# EAGLE schematic Arduino_I2C_LCD_Motor-Driver (EAGLE 8.6.0)
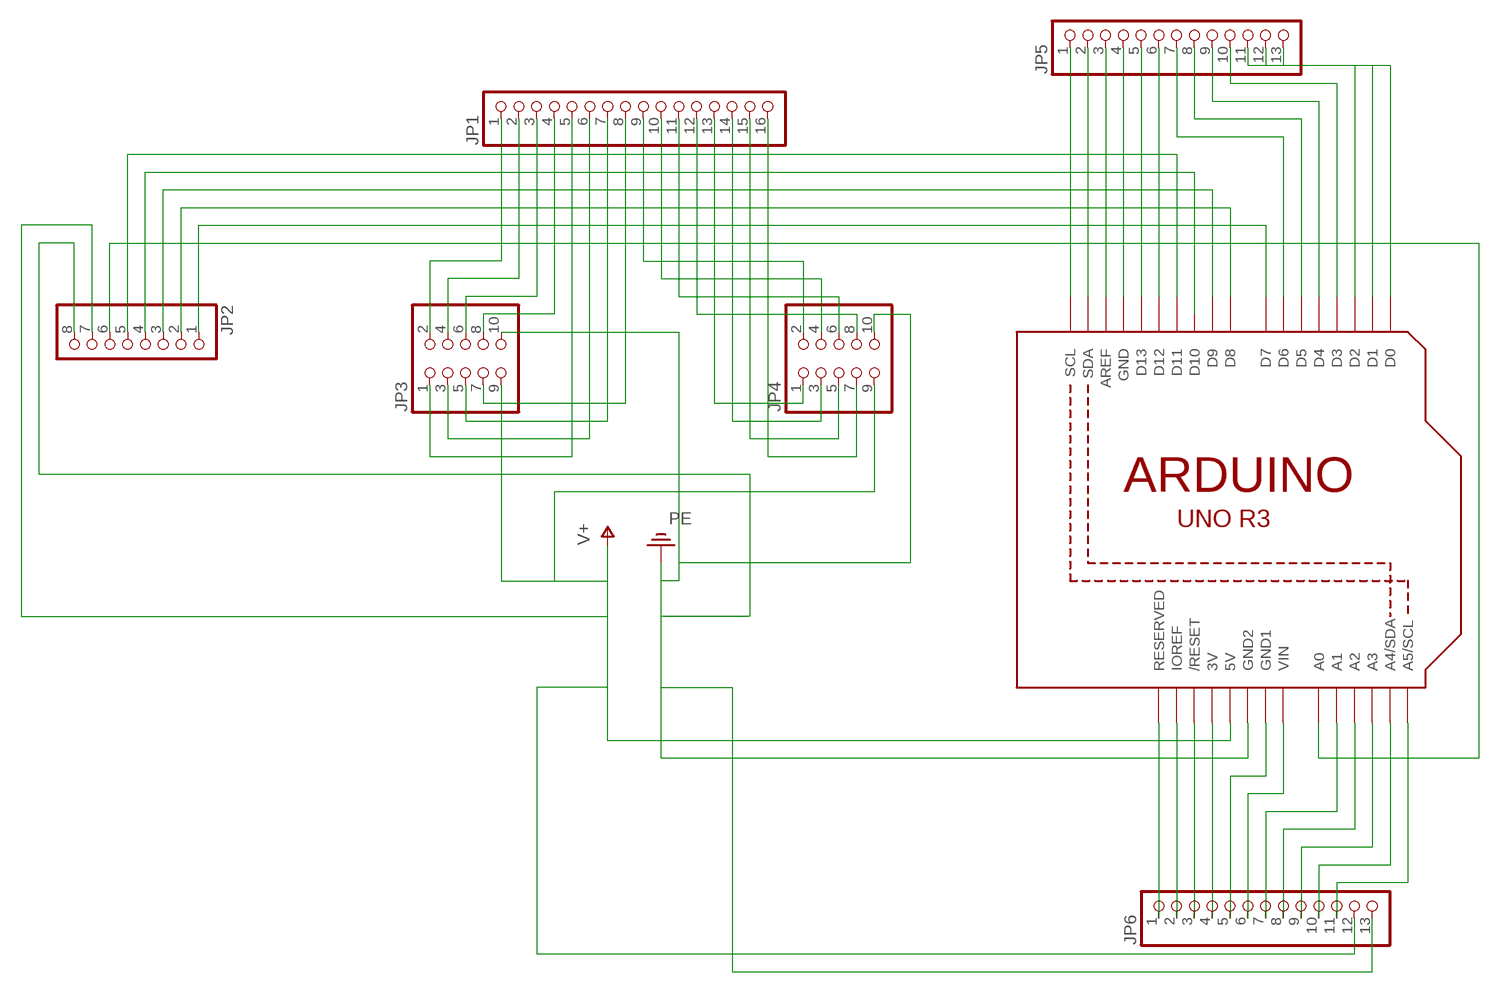
[diagram p0: schematic, sheet 1]

## Parts
JP1  PINHD-1X16  [1X16]
JP2  PINHD-1X8  [1X08]
JP3  PINHD-2X5  [2X05]
JP4  PINHD-2X5  [2X05]
JP5  PINHD-1X13  [1X13]
JP6  PINHD-1X13  [1X13]
U1  ARDUINOR3-BPLACE  [ARDUINOR3-BPLACE]

## Nets
N$1: JP2.2 U1.D8
N$2: JP2.3 U1.D9
N$3: JP2.1 U1.D7
N$4: JP2.4
N$5: JP2.5 U1.D11
N$6: JP1.1 JP3.2
N$7: JP1.2 JP3.4
N$8: JP2.6 U1.A0
N$9: JP1.3 JP3.6
N$10: JP1.4 JP3.8
N$11: JP1.5 JP3.1
N$12: JP1.6 JP3.3
N$13: JP1.7 JP3.5
N$14: JP1.8 JP3.7
N$15: JP1.9 JP4.2
N$16: JP1.10 JP4.4
N$17: JP1.11 JP4.6
N$18: JP1.12 JP4.8
N$19: JP1.13 JP4.1
N$20: JP1.14 JP4.3
N$21: JP1.15 JP4.5
N$22: JP1.16 JP4.7
N$23: JP5.1 U1.SCL
N$24: JP5.2 U1.SDA
N$25: JP5.3 U1.AREF
N$26: JP5.4 U1.GND
N$27: JP5.5 U1.D13
N$28: JP5.6 U1.D12
N$29: JP5.7 U1.D6
N$30: JP5.8 U1.D5
N$31: JP5.9 U1.D4
N$32: JP5.10 U1.D3
N$33: JP5.11 U1.D2
N$34: JP5.12 U1.D1
N$35: JP5.13 U1.D0
N$36: JP6.1 U1.RESERVED
N$37: JP6.2 U1.IOREF
N$38: JP6.3 U1.RESET(/RESET)
N$39: JP6.4 U1.3V
N$40: JP6.5 U1.GND1
N$41: JP6.6 U1.VIN
N$42: JP6.7 U1.A1
N$43: JP6.8 U1.A2
N$44: JP6.9 U1.A3
N$45: JP6.10 U1.A4(A4/SDA)
N$46: JP6.11 U1.A5(A5/SCL)
PE: JP2.8 JP3.10 JP4.10 JP6.13 U1.GND2
V+: JP2.7 JP3.9 JP4.9 JP6.12 U1.5V
Unconnected: U1.D10

## Library data of the parts
JP1 = pinhead:PINHD-1X16: PIN HEADER
JP2 = pinhead:PINHD-1X8: PIN HEADER
JP3 JP4 = pinhead:PINHD-2X5: PIN HEADER
JP5 JP6 = pinhead:PINHD-1X13: PIN HEADER
U1 = adafruit:ARDUINOR3: This is a new object for the new Arduino R3 - with extra pins that you may want to use (such as IOref, and duplicated A4/A5